# EAGLE design poe-neopixel-controller-v2 (EAGLE 7.7.0)

## Sheet 1 of 2
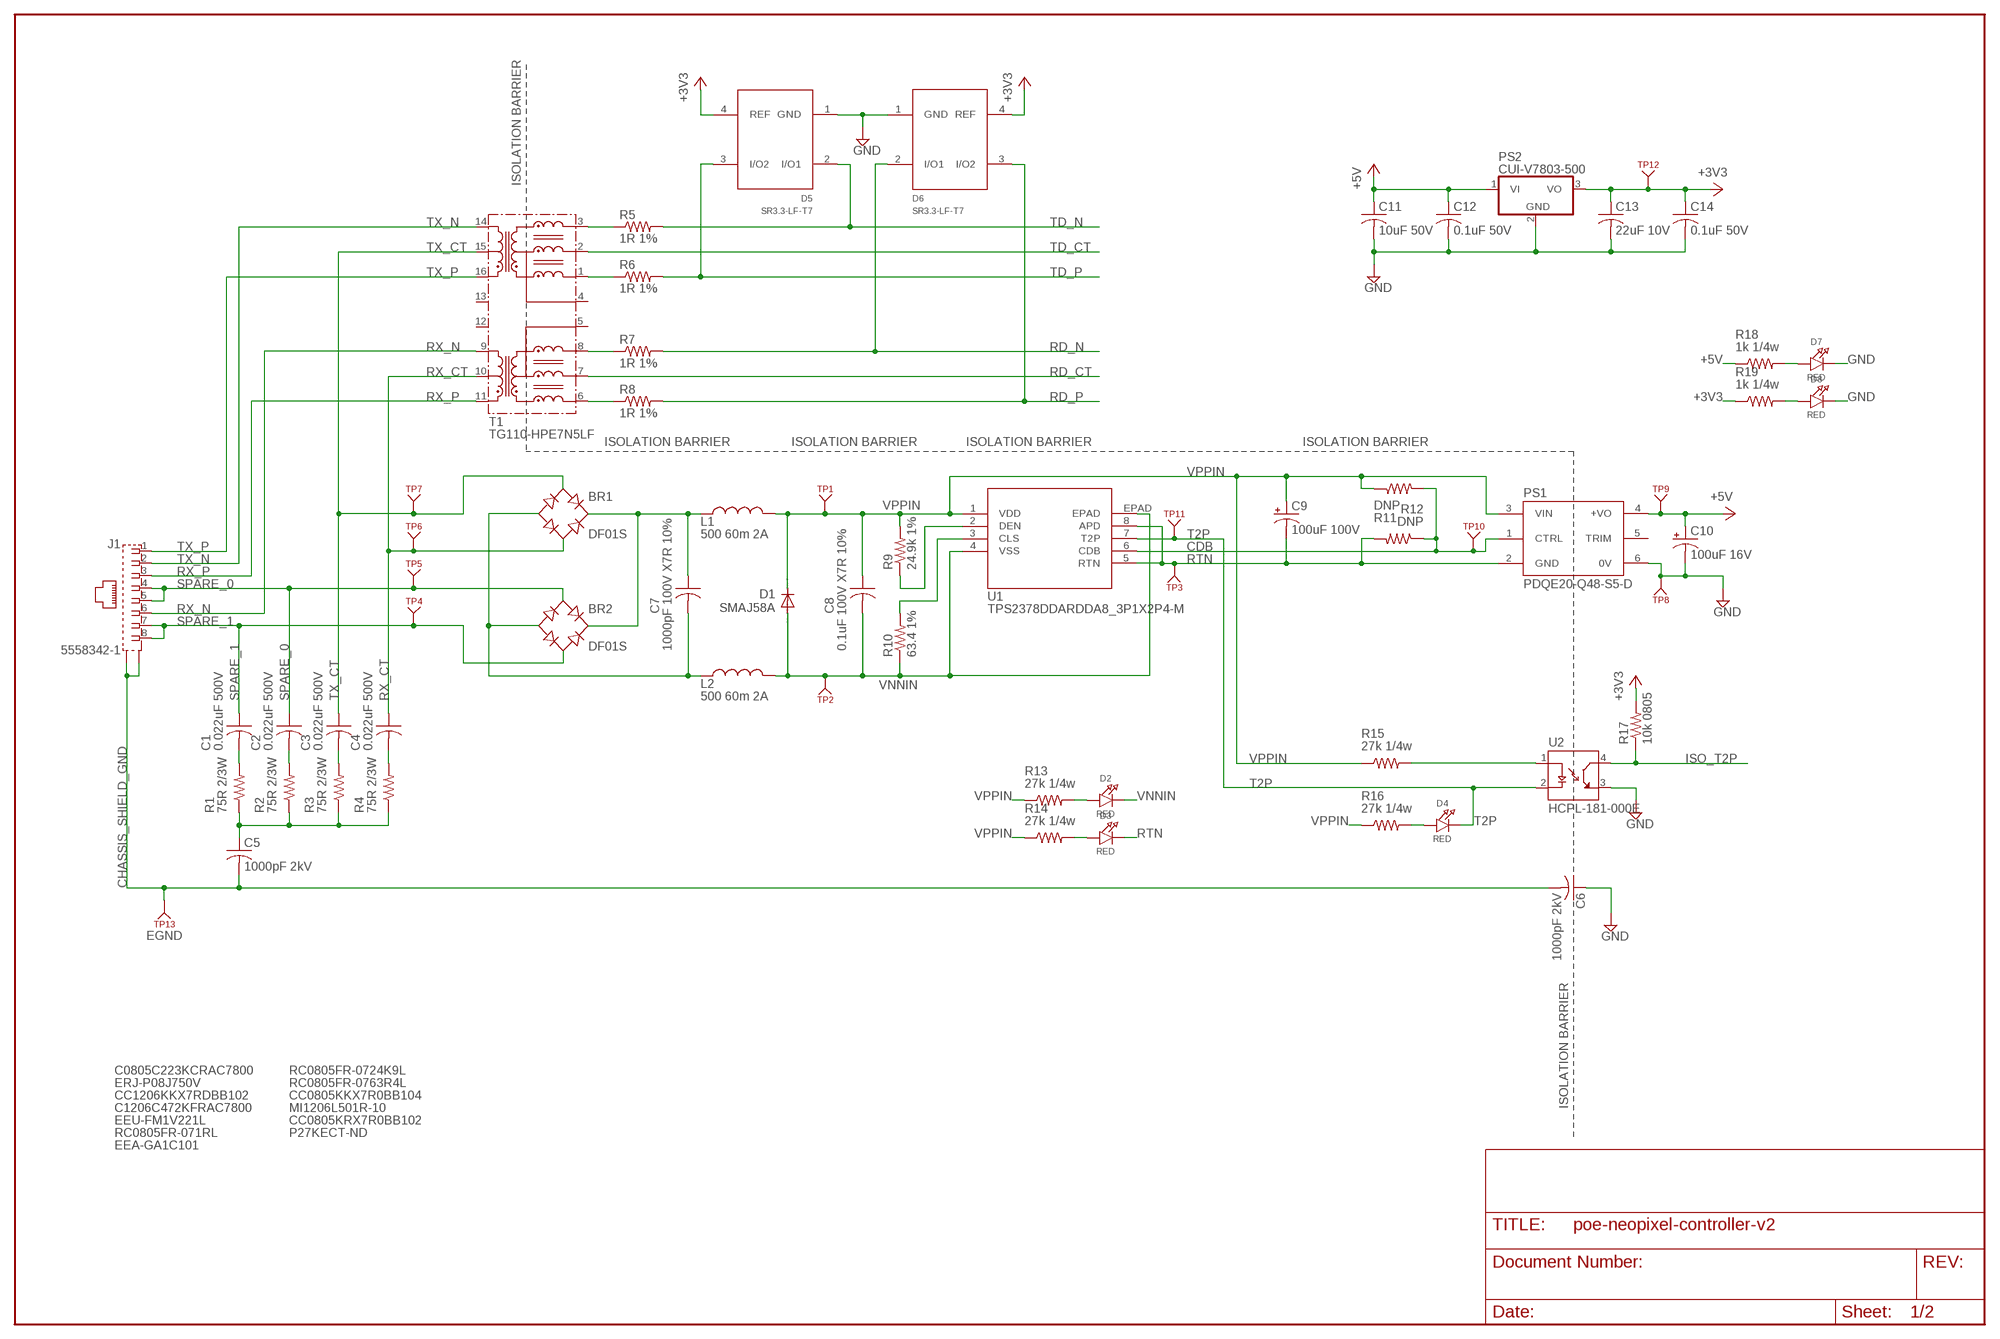
[diagram p0: schematic, sheet 1]

### Parts
BR1  DF01S  [DFS]
BR2  DF01S  [DFS]
C1  0.022uF 500V  C-USC1206  [C1206]
C2  0.022uF 500V  C-USC1206  [C1206]
C3  0.022uF 500V  C-USC1206  [C1206]
C4  0.022uF 500V  C-USC1206  [C1206]
C5  1000pF 2kV  C-USC1206K  [C1206K]
C6  1000pF 2kV  C-USC1206K  [C1206K]
C7  1000pF 100V X7R 10%  C-USC0805  [C0805]
C8  0.1uF 100V X7R 10%  C-USC0805  [C0805]
C9  100uF 100V  CPOL-USE5-10.5  [E5-10,5]
C10  100uF 16V  CPOL-USE2.5-7  [E2,5-7]
C11  10uF 50V  C-USC1210K  [C1210K]
C12  0.1uF 50V  C-USC0805  [C0805]
C13  22uF 10V  C-USC1206K  [C1206K]
C14  0.1uF 50V  C-USC0805  [C0805]
D1  SMAJ58A  DIODE-DO214AC  [DO214AC]
D2  RED  LED0805_NOOUTLINE  [CHIPLED_0805_NOOUTLINE]
D3  RED  LED0805_NOOUTLINE  [CHIPLED_0805_NOOUTLINE]
D4  RED  LED0805_NOOUTLINE  [CHIPLED_0805_NOOUTLINE]
D5  SR3.3-LF-T7  [SOT143B]
D6  SR3.3-LF-T7  [SOT143B]
D7  RED  LED0805_NOOUTLINE  [CHIPLED_0805_NOOUTLINE]
D8  RED  LED0805_NOOUTLINE  [CHIPLED_0805_NOOUTLINE]
J1  5558342-1  [TE_5558342-1]
L1  500 60m 2A  L-USL3216C  [L3216C]
L2  500 60m 2A  L-USL3216C  [L3216C]
PS1  PDQE20-Q48-S5-D  [CONV_PDQE20-Q48-S5-D]
PS2  CUI-V7803-500  [CUI-78XX-500]
R1  75R 2/3W  R-US_R1206  [R1206]
R2  75R 2/3W  R-US_R1206  [R1206]
R3  75R 2/3W  R-US_R1206  [R1206]
R4  75R 2/3W  R-US_R1206  [R1206]
R5  1R 1%  R-US_R0805  [R0805]
R6  1R 1%  R-US_R0805  [R0805]
R7  1R 1%  R-US_R0805  [R0805]
R8  1R 1%  R-US_R0805  [R0805]
R9  24.9k 1%  R-US_R0805  [R0805]
R10  63.4 1%  R-US_R0805  [R0805]
R11  DNP  R-US_R1206  [R1206]
R12  DNP  R-US_R1206  [R1206]
R13  27k 1/4w  R-US_R1206  [R1206]
R14  27k 1/4w  R-US_R1206  [R1206]
R15  27k 1/4w  R-US_R1206  [R1206]
R16  27k 1/4w  R-US_R1206  [R1206]
R17  10k 0805  R-US_R0805  [R0805]
R18  1k 1/4w  R-US_R0805  [R0805]
R19  1k 1/4w  R-US_R0805  [R0805]
T1  TG110-HPE7N5LF  [RP-ULTRA]
TP1  KEYSTONE_500X  [KEYSTONE_TP500X]
TP2  KEYSTONE_500X  [KEYSTONE_TP500X]
TP3  KEYSTONE_500X  [KEYSTONE_TP500X]
TP4  KEYSTONE_500X  [KEYSTONE_TP500X]
TP5  KEYSTONE_500X  [KEYSTONE_TP500X]
TP6  KEYSTONE_500X  [KEYSTONE_TP500X]
TP7  KEYSTONE_500X  [KEYSTONE_TP500X]
TP8  KEYSTONE_500X  [KEYSTONE_TP500X]
TP9  KEYSTONE_500X  [KEYSTONE_TP500X]
TP10  KEYSTONE_500X  [KEYSTONE_TP500X]
TP11  KEYSTONE_500X  [KEYSTONE_TP500X]
TP12  KEYSTONE_500X  [KEYSTONE_TP500X]
TP13  KEYSTONE_500X  [KEYSTONE_TP500X]
U1  TPS2378DDARDDA8_3P1X2P4-M  [DDA8_3P1X2P4-M]
U2  HCPL-181-000E  [SOIC254P675X240-4N]

### Nets
+3V3: C13.1 C14.1 D5.4(REF) D6.4(REF) PS2.3(VO) R17.2 R19.1 TP12.1 ; also sheet 2
+5V: C10.+ C11.1 C12.1 PS1.4(+VO) PS2.1(VI) R18.1 TP9.1 ; also sheet 2
CDB: PS1.1(CTRL) R11.2 R12.1 TP10.1 U1.6(CDB)
CHASSIS_SHIELD_GND: C5.2 C6.2 J1.SH1(S1) J1.SH2(S2) TP13.1
GND: C6.1 C10.- C11.2 C12.2 C13.2 C14.2 D5.1(GND) D6.1(GND) D7.C D8.C PS1.6(0V) PS2.2(GND) TP8.1 U2.3(EMITTER) ; also sheet 2
ISO_T2P: R17.1 U2.4(COLLECTOR) ; also sheet 2
N$1: BR1.+ BR2.+ C7.1 L1.1
N$2: R5.1 T1.3
N$3: BR1.- BR2.- C7.2 L2.1
N$4: R6.1 T1.1
N$5: C4.2 R4.2
N$6: R7.1 T1.8
N$7: D2.A R13.2
N$12: R15.2 U2.1(ANODE)
N$13: R8.1 T1.6
N$14: C1.2 R1.2
N$15: C2.2 R2.2
N$16: C3.2 R3.2
N$17: C5.1 R1.1 R2.1 R3.1 R4.1
N$19: R9.1 U1.2(DEN)
N$20: R10.2 U1.3(CLS)
N$22: D3.A R14.2
N$23: D4.A R16.2
N$24: D7.A R18.2
N$25: D8.A R19.2
RD_CT: T1.7 ; also sheet 2
RD_N: D6.2(I/O1) R7.2 ; also sheet 2
RD_P: D6.3(I/O2) R8.2 ; also sheet 2
RTN: C9.- D3.C PS1.2(GND) R12.2 TP3.1 U1.5(RTN) U1.8(APD)
RX_CT: BR1.AC2 C4.1 T1.10 TP6.1
RX_N: J1.6 T1.9
RX_P: J1.3 T1.11
SPARE_0: BR2.AC1 C2.1 J1.4 J1.5 TP5.1
SPARE_1: BR2.AC2 C1.1 J1.7 J1.8 TP4.1
T2P: D4.C TP11.1 U1.7(T2P) U2.2(CATHODE)
TD_CT: T1.2 ; also sheet 2
TD_N: D5.2(I/O1) R5.2 ; also sheet 2
TD_P: D5.3(I/O2) R6.2 ; also sheet 2
TX_CT: BR1.AC1 C3.1 T1.15 TP7.1
TX_N: J1.2 T1.14
TX_P: J1.1 T1.16
VNNIN: C8.2 D1.A D2.C L2.2 R10.1 TP2.1 U1.4(VSS) U1.EPAD
VPPIN: C8.1 C9.+ D1.C L1.2 PS1.3(VIN) R9.2 R11.1 R13.1 R14.1 R15.1 R16.1 TP1.1 U1.1(VDD)
Unconnected: PS1.5(TRIM) T1.4 T1.5 T1.12 T1.13

### Notes on the sheet
- ISOLATION BARRIER
- ISOLATION BARRIER | ISOLATION BARRIER | ISOLATION BARRIER | ISOLATION BARRIER
- EGND
- C0805C223KCRAC7800 | RC0805FR-0724K9L
- ERJ-P08J750V | RC0805FR-0763R4L
- CC1206KKX7RDBB102 | CC0805KKX7R0BB104
- ISOLATION BARRIER
- C1206C472KFRAC7800 | MI1206L501R-10
- EEU-FM1V221L | CC0805KRX7R0BB102
- RC0805FR-071RL | P27KECT-ND
- EEA-GA1C101

## Sheet 2 of 2
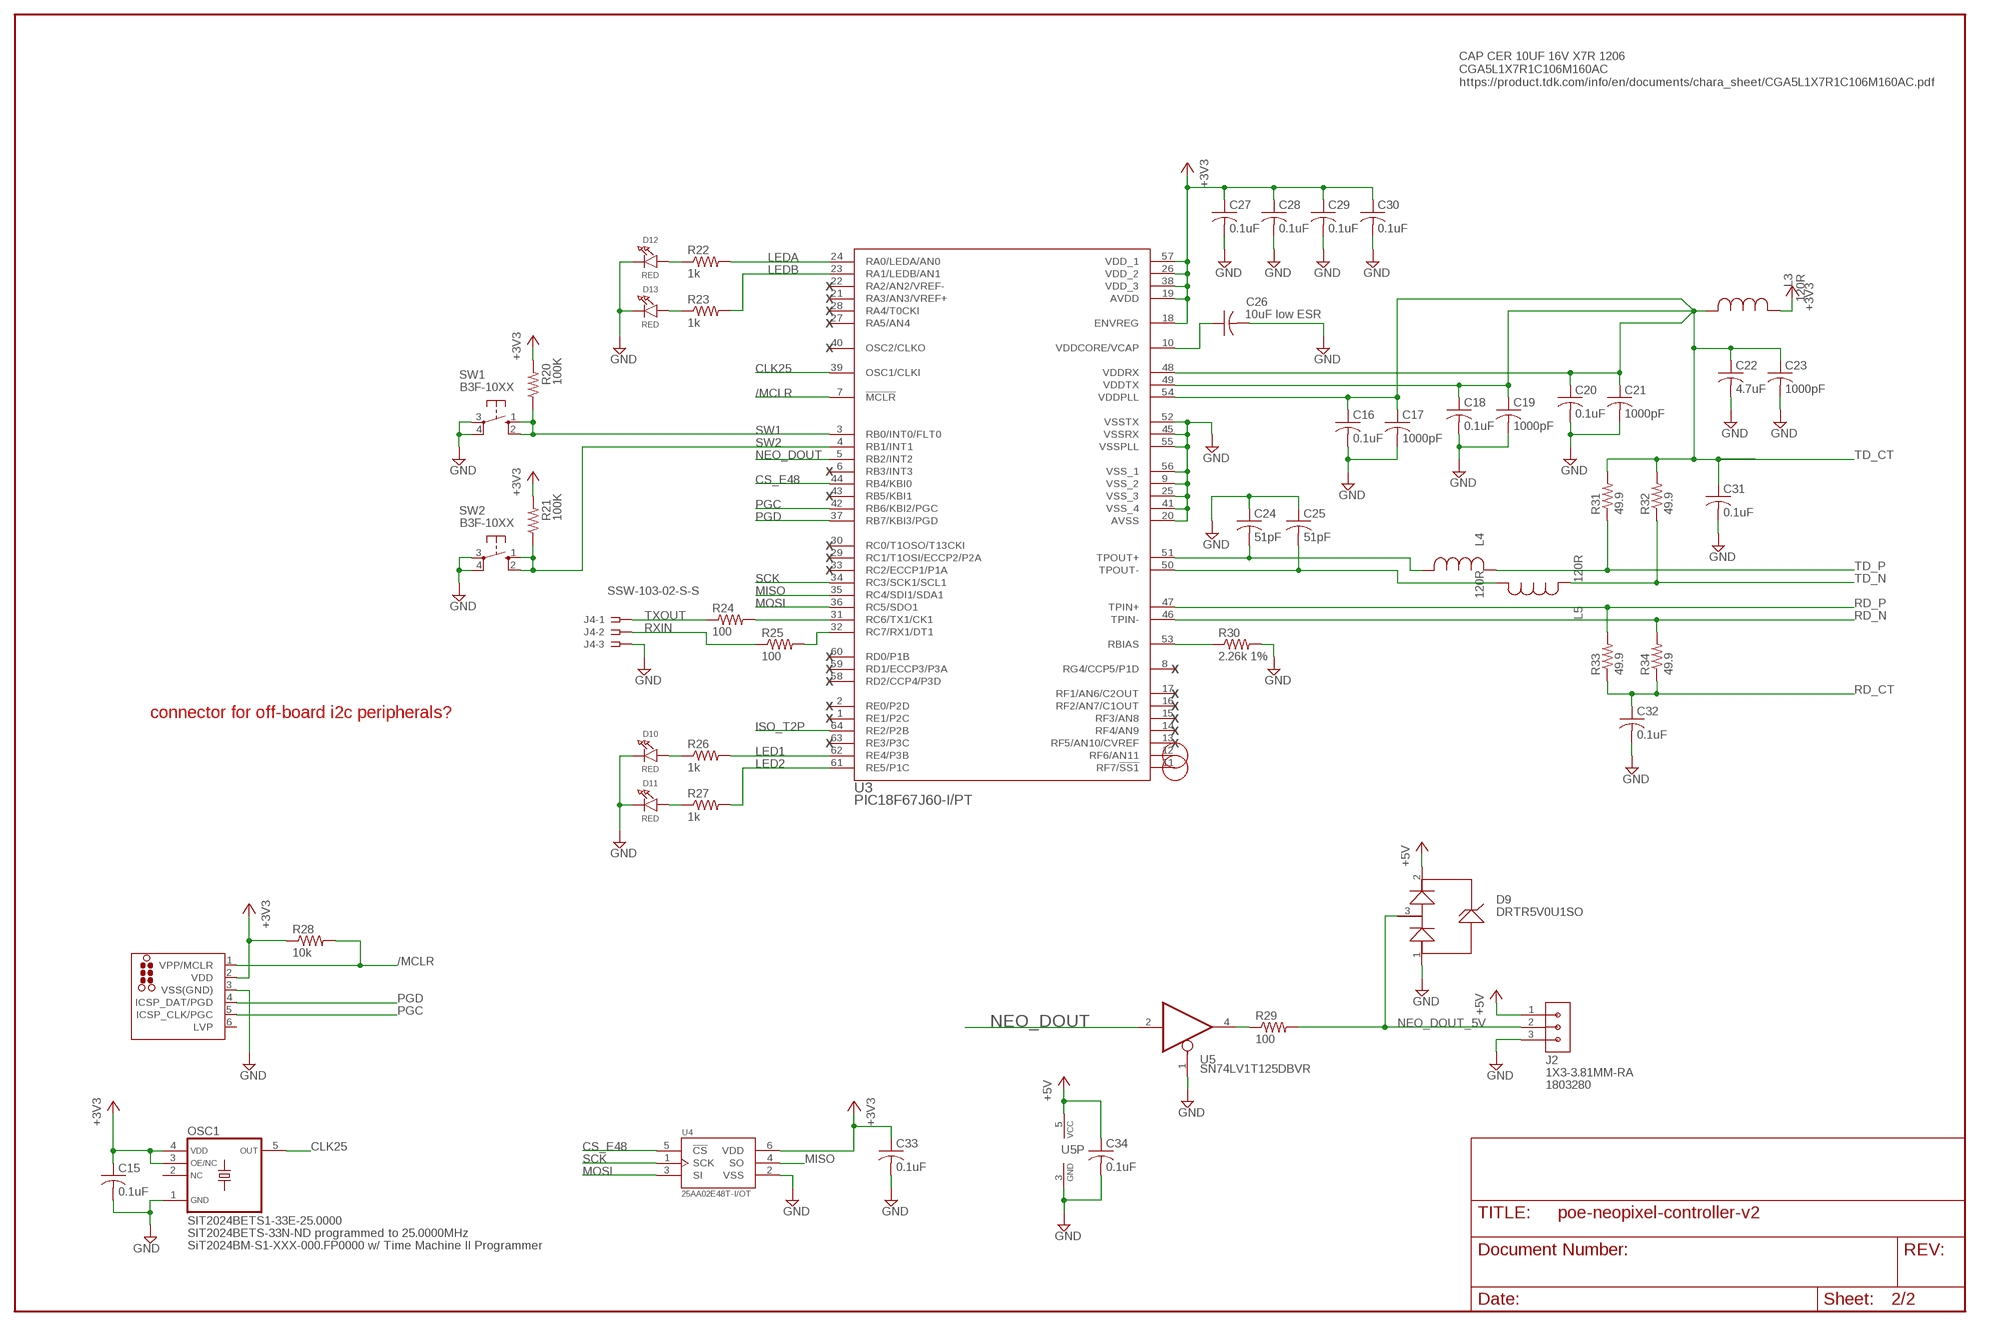
[diagram p1: schematic, sheet 2]

### Parts
C15  0.1uF  C-USC0603  [C0603]
C16  0.1uF  C-USC0805  [C0805]
C17  1000pF  C-USC0805  [C0805]
C18  0.1uF  C-USC0805  [C0805]
C19  1000pF  C-USC0805  [C0805]
C20  0.1uF  C-USC0805  [C0805]
C21  1000pF  C-USC0805  [C0805]
C22  4.7uF  C-USC0805  [C0805]
C23  1000pF  C-USC0805  [C0805]
C24  51pF  C-USC0805  [C0805]
C25  51pF  C-USC0805  [C0805]
C26  10uF low ESR  C-USC1206  [C1206]
C27  0.1uF  C-USC0603  [C0603]
C28  0.1uF  C-USC0603  [C0603]
C29  0.1uF  C-USC0603  [C0603]
C30  0.1uF  C-USC0603  [C0603]
C31  0.1uF  C-USC0805  [C0805]
C32  0.1uF  C-USC0805  [C0805]
C33  0.1uF  C-USC0603  [C0603]
C34  0.1uF  C-USC0603  [C0603]
D9  DRTR5V0U1SO  [SOT23-3]
D10  RED  LED0805_NOOUTLINE  [CHIPLED_0805_NOOUTLINE]
D11  RED  LED0805_NOOUTLINE  [CHIPLED_0805_NOOUTLINE]
D12  RED  LED0805_NOOUTLINE  [CHIPLED_0805_NOOUTLINE]
D13  RED  LED0805_NOOUTLINE  [CHIPLED_0805_NOOUTLINE]
J2  1X3-3.81MM-RA  CON-3.81MM-1X3-PHOENIX-RA  [CON-PHOENIX-3.81-1X3-RA]
J3  TC2030-MCP-NL  [TC2030-MCP-NL]
J4  SSW-103-02-S-S  [SSW-103-02-S-S]
L3  120R  MMZ1608B121CTAH0IND_1608-M  [IND_1608-M]
L4  120R  MMZ1608B121CTAH0IND_1608-M  [IND_1608-M]
L5  120R  MMZ1608B121CTAH0IND_1608-M  [IND_1608-M]
OSC1  SIT2024BETS1-33E-25.0000  SIT2024BETS1-33E-10.0000  [SOT23-5]
R20  100K  R-US_R0805  [R0805]
R21  100K  R-US_R0805  [R0805]
R22  1k  R-US_R0805  [R0805]
R23  1k  R-US_R0805  [R0805]
R24  100  R-US_R0805  [R0805]
R25  100  R-US_R0805  [R0805]
R26  1k  R-US_R0805  [R0805]
R27  1k  R-US_R0805  [R0805]
R28  10k  R-US_R0805  [R0805]
R29  100  R-US_R0805  [R0805]
R30  2.26k 1%  R-US_R0805  [R0805]
R31  49.9  R-US_R0805  [R0805]
R32  49.9  R-US_R0805  [R0805]
R33  49.9  R-US_R0805  [R0805]
R34  49.9  R-US_R0805  [R0805]
SW1  B3F-10XX  10-XX  [B3F-10XX]
SW2  B3F-10XX  10-XX  [B3F-10XX]
U3  PIC18F67J60-I/PT  [TQFP64_10X10MC]
U4  25AA02E48T-I/OT  [SOT95P270X145-6N]
U5  SN74LV1T125DBVR  74AHC1G125DBV  [SOT23-5]

### Nets
+3V3: C15.1 C27.1 C28.1 C29.1 C30.1 C33.1 J3.2(VDD) L3.2 OSC1.3(OE/NC) OSC1.4(VDD) R20.2 R21.2 R28.1 U3.18(ENVREG) U3.19(AVDD) U3.26(VDD_2) U3.38(VDD_3) U3.57(VDD_1) U4.6(VDD) ; also sheet 1
+5V: C34.1 D9.2 J2.1 U5.5(VCC) ; also sheet 1
/MCLR: J3.1(VPP/MCLR) R28.2 U3.7(!MCLR)
CLK25: OSC1.5(OUT) U3.39(OSC1/CLKI)
CS_E48: U3.44(RB4/KBI0) U4.5(!CS)
DATA_5V: R29.1 U5.4(O)
GND: C15.2 C16.2 C17.2 C18.2 C19.2 C20.2 C21.2 C22.2 C23.2 C24.1 C25.1 C26.2 C27.2 C28.2 C29.2 C30.2 C31.2 C32.2 C33.2 C34.2 D9.1 D10.C D11.C D12.C D13.C J2.3 J3.3(VSS(GND)) J4.3 OSC1.1(GND) R30.2 SW1.3(P) SW1.4(P1) SW2.3(P) SW2.4(P1) U3.9(VSS_2) U3.20(AVSS) U3.25(VSS_3) U3.41(VSS_4) U3.45(VSSRX) U3.52(VSSTX) U3.55(VSSPLL) U3.56(VSS_1) U4.2(VSS) U5.1(OE) U5.3(GND) ; also sheet 1
ISO_T2P: U3.64(RE2/P2B) ; also sheet 1
LED1: R26.2 U3.62(RE4/P3B)
LED2: R27.2 U3.61(RE5/P1C)
LEDA: R22.2 U3.24(RA0/LEDA/AN0)
LEDB: R23.2 U3.23(RA1/LEDB/AN1)
MISO: U3.35(RC4/SDI1/SDA1) U4.4(SO)
MOSI: U3.36(RC5/SDO1) U4.3(SI)
N$8: C26.1 U3.10(VDDCORE/VCAP)
N$9: R30.1 U3.53(RBIAS)
N$10: D13.A R23.1
N$11: D10.A R26.1
N$18: D11.A R27.1
N$21: D12.A R22.1
NEO_DOUT: U3.5(RB2/INT2) U5.2(I)
NEO_DOUT_5V: D9.3 J2.2 R29.2
PGC: J3.5(ICSP_CLK/PGC) U3.42(RB6/KBI2/PGC)
PGD: J3.4(ICSP_DAT/PGD) U3.37(RB7/KBI3/PGD)
RD_CT: C32.1 R33.1 R34.1 ; also sheet 1
RD_N: R34.2 U3.46(TPIN-) ; also sheet 1
RD_P: R33.2 U3.47(TPIN+) ; also sheet 1
RXD: R25.2 U3.32(RC7/RX1/DT1)
RXIN: J4.2 R25.1
SCK: U3.34(RC3/SCK1/SCL1) U4.1(SCK)
SW1: R20.1 SW1.1(S) SW1.2(S1) U3.3(RB0/INT0/FLT0)
SW2: R21.1 SW2.1(S) SW2.2(S1) U3.4(RB1/INT1)
TD_CT: C16.1 C17.1 C18.1 C19.1 C20.1 C21.1 C22.1 C23.1 C31.1 L3.1 R31.2 R32.2 U3.48(VDDRX) U3.49(VDDTX) U3.54(VDDPLL) ; also sheet 1
TD_N: L5.2 R32.1 ; also sheet 1
TD_P: L4.2 R31.1 ; also sheet 1
TDF_N: C25.2 L5.1 U3.50(TPOUT-)
TDF_P: C24.2 L4.1 U3.51(TPOUT+)
TXD: R24.2 U3.31(RC6/TX1/CK1)
TXOUT: J4.1 R24.1
Unconnected: J3.6(LVP) OSC1.2(NC) U3.1(RE1/P2C) U3.2(RE0/P2D) U3.6(RB3/INT3) U3.8(RG4/CCP5/P1D) U3.11(RF7/!SS1) U3.12(RF6/AN11) U3.13(RF5/AN10/CVREF) U3.14(RF4/AN9) U3.15(RF3/AN8) U3.16(RF2/AN7/C1OUT) U3.17(RF1/AN6/C2OUT) U3.21(RA3/AN3/VREF+) U3.22(RA2/AN2/VREF-) U3.27(RA5/AN4) U3.28(RA4/T0CKI) U3.29(RC1/T1OSI/ECCP2/P2A) U3.30(RC0/T1OSO/T13CKI) U3.33(RC2/ECCP1/P1A) U3.40(OSC2/CLKO) U3.43(RB5/KBI1) U3.58(RD2/CCP4/P3D) U3.59(RD1/ECCP3/P3A) U3.60(RD0/P1B) U3.63(RE3/P3C)

### Notes on the sheet
- CAP CER 10UF 16V X7R 1206
  CGA5L1X7R1C106M160AC 
  https://product.tdk.com/info/en/documents/chara_sheet/CGA5L1X7R1C106M160AC.pdf
- X
- X
- X
- X
- X
- X
- X
- X
- X
- X
- X
- X | X
- X
- X
- X | X
- connector for off-board i2c peripherals? | X | X
- X
- X | X
- SIT2024BETS-33N-ND programmed to 25.0000MHz
- SiT2024BM-S1-XXX-000.FP0000 w/ Time Machine II Programmer

## Library data of the parts
BR1 BR2 = rectifier:DF*S: Surface Mount Glass Passivated Bridge Rectifiers Source: Source: Comchip Bridge Rectifiers DF005S-G thru DF10S-G.pdf
C1-C8 C15-C25 C27-C34 = rcl:C-US: CAPACITOR, American symbol
C9 C10 = rcl:CPOL-US: POLARIZED CAPACITOR, American symbol
C11 = rcl:C-US: CAPACITOR, American symbol; MFR: KEMET; MFR_PART_NO: C1210C106K5RACTU
C12 C14 = rcl:C-US: CAPACITOR, American symbol; MFR: KEMET; MFR_PART_NO: C1206S104M5RACTU
C13 = rcl:C-US: CAPACITOR, American symbol; MFR: KEMET; MFR_PART_NO: C1206C226K8RAC7800
C26 = resistor:C-US: CAPACITOR, American symbol
D1 = diode:DIODE-: DIODE
D2-D4 D7 D8 D10-D13 = microbuilder:LED: LED 0603 - 0603 Surface Mount Package 2mA: Green LED - Low Power (3.9mcd, 2ma, 1.7Vf) - Digikey: 475-2709-2-ND Orange LED - Low Power (9.8mcd, 2ma, 1.8Vf) - Digikey: 475-1194-2-ND Red LED - Low Power (5mcd, 2ma, 1.8Vf) - Digikey: 475-1195-2-ND Yellow LED - Low Power (7mcd, 2ma, 1.8Vf) - Digikey: 475-1196-2-ND 5mA: Blue LED - Low Power (17mcd, 5ma, 2.9Vf) - Digikey: LNJ937W8CRACT-ND 0805 - 0805 Surface Mount Package 2mA: Red LED (8.8mcd, 2mA, 1.8Vf, Clear) - Low Power [Digikey: 475-2510-1-ND] Green LED (5mcd, 2mA, 1.8Vf, Clear) - Low Power [Digikey: 475-2730-1-ND] Yellow LED (11.3mcd, 2mA, 1.8Vf, Clear) - Low Power [Digikey: 475-2555-1-ND] 20mA: Red LED (104mcd, 20mA, Diffused) - LS R976 [Digikey: 475-1278-6-ND] Red LED (12mcd, 20mA, 2.0Vf, Clear) - APT2012EC [Digikey: 754-1128-1-ND] Green LED (15mcd, 20mA, 2.2Vf, Clear) - APT2012GC [Digikey: 754-1131-1-ND] Orange LED (160mcd, 20mA, 2.1Vf, Clear) - APT2012SECK [Digikey: 754-1130-1-ND] 1206 - 1206 Surface Mount Package Green LED (26mcd, 20mA, Diffused) - LG N971 [Digikey: 475-1407-6-ND] Red LED (15mcd, 20mA, Diffused) - LH N974 [Digikey: 475-1416-6-ND] Cree - Cree High-Power Surface Mount LEDs XPEBWT-L1-0000-00D50 - White 111lm 350mA 2.9Vf 6200K 110° XTEAWT-00-0000-00000LEE3 - White 114lm 350mA 2.85Vf 5000K 115° Everlight - Everlight 45-21 Series Surface Mount LEDs 45-21/QK2C-B2832AC2CB2/2T - Warm White 2000mcd 20mA 3.25Vf 3050K 120° 45-21/LK2C-B38452C4CB2/2T - Nuetral White 2000mcd 20mA 3.25Vf 4150K 120° 45-21/LK2C-B50634C6CB2/2T - Cold White 2200mcd 20mA 3.25Vf 5650K 120° PLCC2 Reverse Mount LS T77K-J1L2-1-0-2-R18-Z - Red 11.25mcd 2mA 1.8Vf 630nm 120° LO T77K-L1M2-24-Z - Orange 19.6mcd 2mA 1.8Vf 606nm 120° LY T77K-K2M1-26-Z - Yellow 15.7mcd 2mA 1.8Vf 587nm 120°
D5 D6 = protek-devices:SR3.3-LF-T7
D9 = GlenPartsLibrary:DRTR5V0U1SO; MFR: DIODES INC; MFR_PART_NO: DRTR5V0U1SO
J1 = 5558342-1:5558342-1: CONN MOD JACK 8P8C R/A SHIELDED; COMMENT: 5558342-1; DESCRIPTION: Conn RJ-45 F 8 POS 2.54mm Solder RA Thru-Hole 8 Terminal 1 Port Cat 5 Box/Tray; DIGI-KEY_PART_NUMBER: A31466-ND; DIGI-KEY_PURCHASE_URL: https://www.digikey.com/product-detail/en/te-connectivity-amp-connectors/5558342-1/A31466-ND/769610?utm_source=snapeda&utm_medium=aggregator&utm_campaign=symbol; EU_ROHS_COMPLIANCE: Compliant; MF: TE Connectivity; MP: 5558342-1; PACKAGE: None; TE_PURCHASE_URL: https://www.te.com/usa-en/product-5558342-1.html?te_bu=Cor&te_type=disp&te_campaign=seda_glo_cor-seda-global-disp-prtnr-fy19-seda-model-bom-cta_sma-317_1&elqCampaignId=32493
J2 = 0GlenConnectors:CON-3.81MM-1X3-PHOENIX-RA; MATES_WITH: 1803581; MFR: PHOENIX; MFR_PART_NO: 1803280
J3 = tag-connect:TC2030: TAG-CONNECT ICSP Connector Manufacturer: Tag-Connect <http://www.tag-connect.com> Cable for easy In-Circuit Serial Programming. Designed for Microchip ICD2, suitable for many others. Two variants - one "with legs" (for hands-free fit on PCB) and another "without legs" for quick programming. PAD Description 1 MCLR/Vpp 2 Vdd 3 GND 4 PGD (ISPDAT) 5 PGC (ISPCLK) 6 nc (used for LVP) ©2009 ROFA.cz - modified and updated by Robert Darlington ‹rdarlington@gmail.com›
J4 = con-samtec:SSW-103-02-S-S: THROUGH-HOLE .025" SQ POST SOCKET Source: Samtec SSW.pdf; MPN: SSW-103-02-S-S; OC_FARNELL: unknown; OC_NEWARK: 11P9367
L1 L2 = rcl:L-US: INDUCTOR, American symbol
L3-L5 = MMZ1608B121CTAH0:MMZ1608B121CTAH0; BUILT_BY: EMA_UL_Team; MANUFACTURER_PART_NUMBER: MMZ1608B121CTAH0; VENDOR: TDK
OSC1 = Glen-SiTime:SIT2024BETS1-33E-10.0000
PS1 = PDQE20-Q48-S5-D:PDQE20-Q48-S5-D: 20 W, 4:1 Input Range, Single/Dual Regulated Output, DIP, 1500 Vdc Isolation, DC-Dc Converter; CUI_PURCHASE_URL: https://www.cui.com/product/dc-dc-converters/isolated/pdqe20-d-series?utm_source=snapeda.com&utm_medium=referral&utm_campaign=snapedaBOM; DESCRIPTION: 20 W, 4:1 Input Range, Single/Dual Regulated Output, DIP, 1500 Vdc Isolation, Dc-Dc Converter; DIGI-KEY_PART_NUMBER: 102-6272-ND; DIGI-KEY_PURCHASE_URL: https://www.digikey.com/product-detail/en/cui-inc/PDQE20-Q48-S5-D/102-6272-ND/10230161?utm_source=snapeda&utm_medium=aggregator&utm_campaign=symbol; MF: CUI Inc.; MP: PDQE20-Q48-S5-D; PACKAGE: DIP-6 CUI Inc.
PS2 = GlenPartsLibrary:CUI-V7803-500
R1-R16 R18-R34 = rcl:R-US_: RESISTOR, American symbol
R17 = resistor:R-US_: RESISTOR, American symbol
SW1 SW2 = switch-omron:10-XX: OMRON SWITCH
T1 = halo-rp-ultra-magnetics:TG110-HPE7N5LF
TP1-TP13 = 0GlenConnectors:KEYSTONE_500X
U1 = TPS2378DDAR:TPS2378DDAR; MANUFACTURER_PART_NUMBER: TPS2378DDAR; VENDOR: Texas Instruments
U2 = HCPL-181-000E:HCPL-181-000E: Optocoupler; SMD; Channels: 1; Out: transistor; Uinsul: 3.75kV; SO4; DESCRIPTION: Optocoupler; SMD; Channels: 1; Out: transistor; Uinsul: 3.75kV; SO4; DIGI-KEY_PART_NUMBER: 516-1646-1-ND; DIGI-KEY_PURCHASE_URL: https://www.digikey.com/product-detail/en/broadcom-limited/HCPL-181-000E/516-1646-1-ND/825340?utm_source=snapeda&utm_medium=aggregator&utm_campaign=symbol; MF: Broadcom Limited; MP: HCPL-181-000E; PACKAGE: SO-4 Broadcom
U3 = pic18f67j60:PIC18F67J60-I/PT; MANUFACTURER_PART_NUMBER: PIC18F67J60IPT; VENDOR: Microchip
U4 = 25AA02E48T-I_OT:25AA02E48T-I/OT: 25AA02E48 Series 2 Kbit (256 x 8) 5.5 V SMT SPI Bus Serial EEPROM - SOT-23-6; DESCRIPTION: 25AA02E48 Series 2 Kbit _256 x 8_ 5.5 V SMT SPI Bus Serial EEPROM - SOT-23-6; DIGI-KEY_PART_NUMBER: 25AA02E48T-I/OTCT-ND; DIGI-KEY_PURCHASE_URL: https://www.digikey.com/product-detail/en/microchip-technology/25AA02E48T-I-OT/25AA02E48T-I-OTCT-ND/2060055?utm_source=snapeda&utm_medium=aggregator&utm_campaign=symbol; MF: Microchip; MP: 25AA02E48T-I/OT; PACKAGE: SOT-23-6 Microchip
U5 = 74xx-little-us:74*1G125: Single Bus Buffer Gate with 3-State Output; MFR: TI; MFR_PART_NO: SN74LV1T125DBVR

## Board
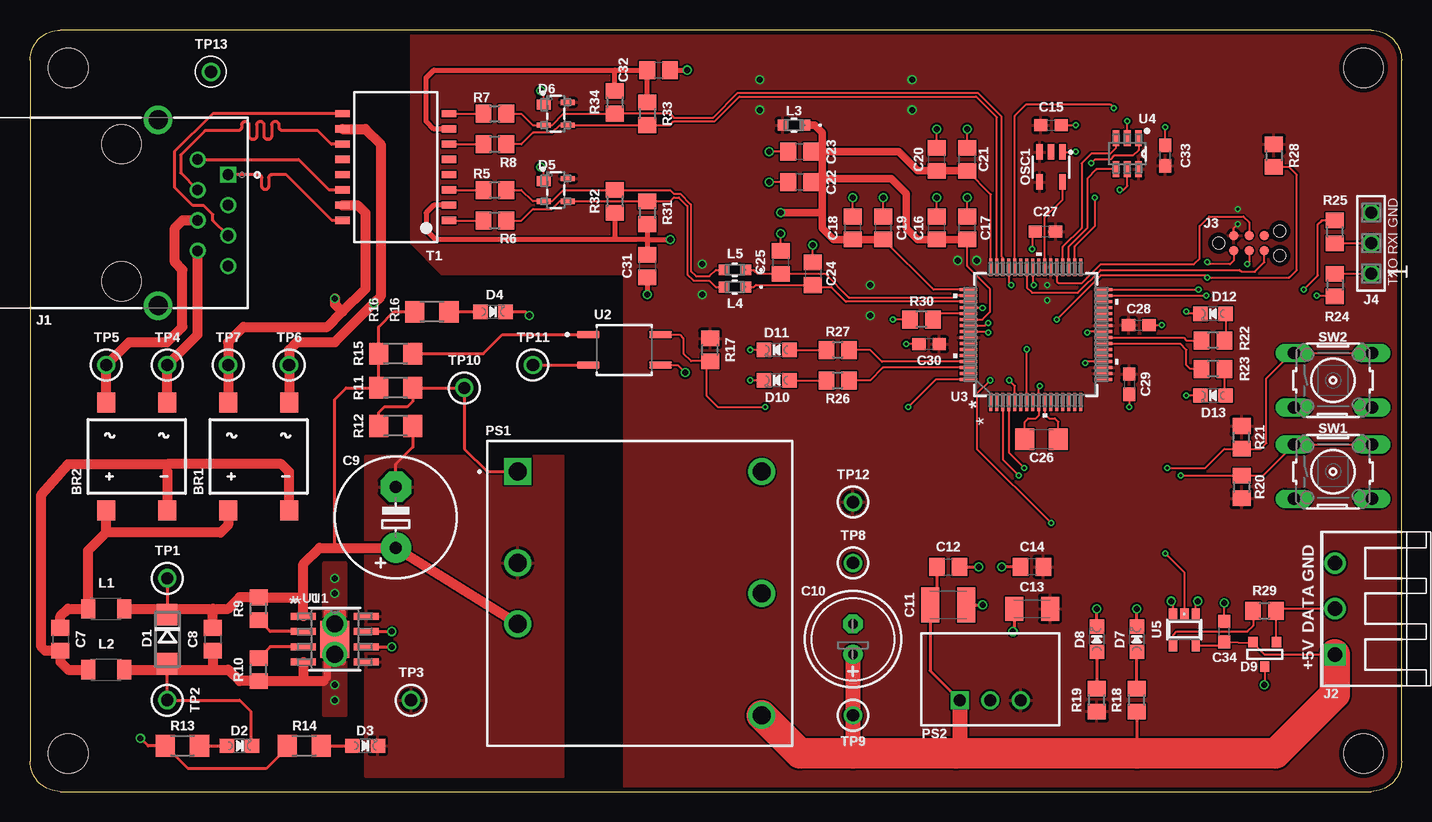
[diagram p2: board, top side]
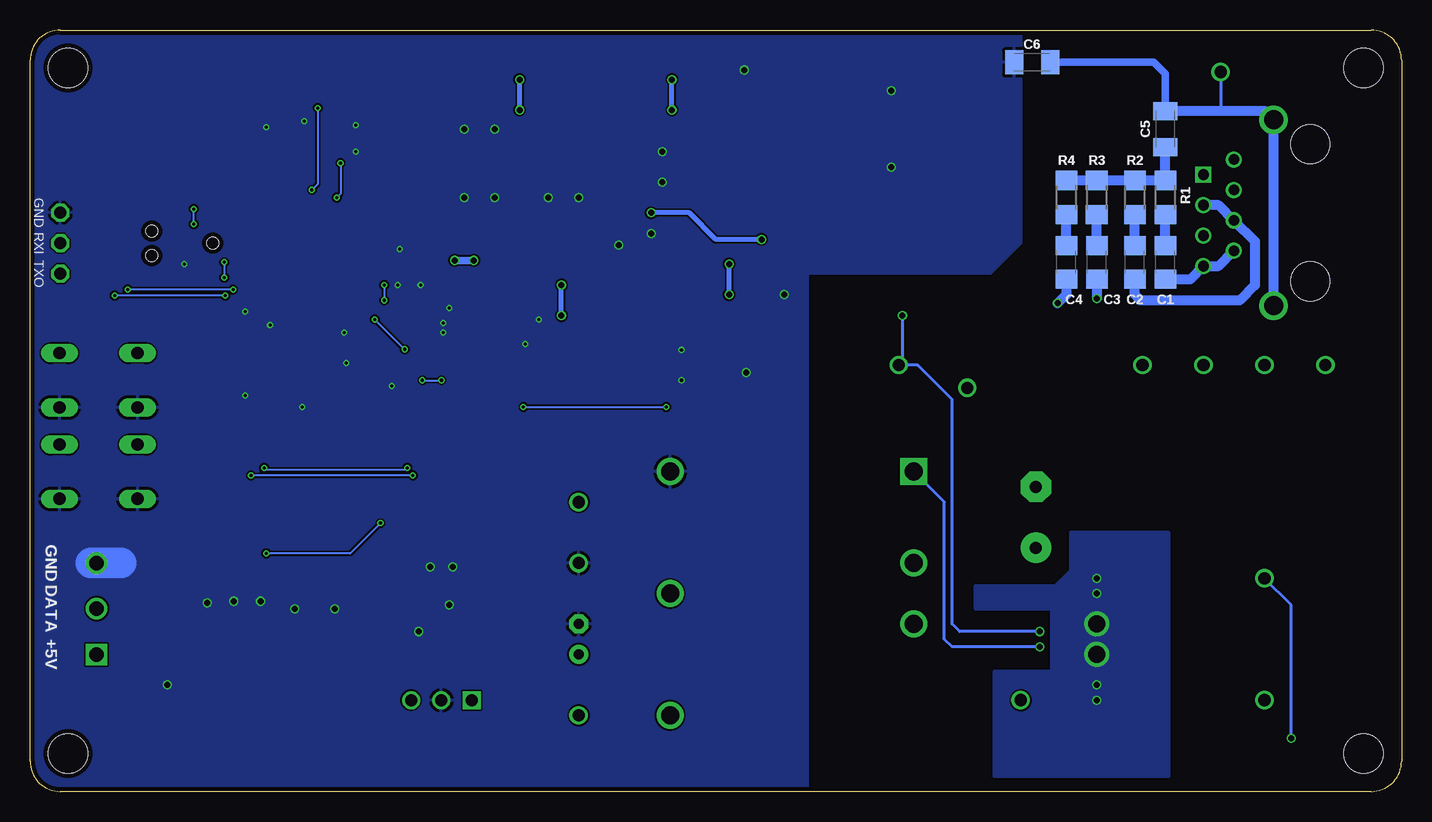
[diagram p3: board, bottom side, seen from below]

Size 114.3 x 63.5 mm. Coordinates in mm from the lower left corner, seen from the top.
Outline: 2.54,0 111.76,0 arc90 114.3,2.54 114.3,60.96 arc90 111.76,63.5 2.54,63.5 arc90 0,60.96 0,2.54 arc90 2.54,0
Copper layers (1*16): Top 0.035559375mm / dielectric 1.6mm / Bottom 0.035559375mm
Design rules "oshpark-2layer-2018": minimum track width 6mil, minimum drill 10mil, track to track 6mil, track to pad 6mil, pad to pad 6mil, via to via 6mil, smd to smd 6mil, copper to edge 15mil, drill to drill 6mil, minimum pad ring 5mil, minimum via ring 5mil, stop-mask expansion 2.5mil, vias tented up to drill 0mil, thermal gap 10mil
Holes 3.3 mm at 3.17,3.17 111.12,60.33 3.17,60.33 111.12,3.17

### Footprints (pad centres in the part's own frame; a part is rotated, then mirrored left to right if it is on the bottom)
DFS = smd 1.5 x 1.7: + -2.55,-4.5; - 2.55,-4.5; AC1 -2.55,4.5; AC2 2.55,4.5
C1206 = smd 1.6 x 1.8: 1 -1.4,0; 2 1.4,0
C1206K = smd 1.5 x 2: 1 -1.5,0; 2 1.5,0
C0805 = smd 1.3 x 1.5: 1 -0.95,0; 2 0.95,0
E5-10,5 = drill 1.016 pad 2.54: + -2.54,0 | drill 1.016 pad 2.54 octagon: - 2.54,0
E2,5-7 = drill 0.813 pad 1.6: + -1.27,0 | drill 0.813 pad 1.6 octagon: - 1.27,0
C1210K = smd 1.5 x 2.9: 1 -1.5,0; 2 1.5,0
C0603 = smd 1.1 x 1: 1 -0.85,0; 2 0.85,0
DO214AC = smd 1.8 x 1.7: A 2.05,0; C -2.05,0
CHIPLED_0805_NOOUTLINE = smd 1.2 x 1.2: A 0,-1.05; C 0,1.05
SOT143B = smd 0.838 x 1.168: 1 -0.747,-1.016 | smd 0.432 x 1.168: 2 0.95,-1.016; 3 0.95,1.016; 4 -0.95,1.016
SOT23-3 = smd 0.889 x 0.787: 1 1.016,0.025; 2 -1.016,-0.94; 3 -1.016,0.991
TE_5558342-1 = drill 0.89 square: 1 -3.175,8.89 | drill 0.89: 2 -4.445,6.35; 3 -1.905,6.35; 4 0.635,6.35; 5 -0.635,8.89; 6 1.905,8.89; 7 4.445,8.89; 8 3.175,6.35 | drill 1.58: SH1 -7.745,3.05; SH2 7.745,3.05 | hole 3.25: -5.715,0; 5.715,0
CON-PHOENIX-3.81-1X3-RA = drill 1.2 square: 1 0,0 | drill 1.2: 2 3.81,0; 3 7.62,0
TC2030-MCP-NL = smd 0.787 x 0.787: 1 1.27,-0.635; 2 1.27,0.635; 3 2.54,-0.635; 4 2.54,0.635; 5 3.81,-0.635; 6 3.81,0.635 | hole 0.991: 0,0; 5.08,-1.016; 5.08,1.016
SSW-103-02-S-S = drill 1 pad 1.5 octagon: 1 -2.54,0; 2 0,0; 3 2.54,0
L3216C = smd 1.2 x 1.6: 1 -1.5,0; 2 1.5,0
IND_1608-M = smd 0.859 x 0.902: 1 -0.929,0; 2 0.929,0
SOT23-5 = smd 1.3 x 0.55: 1 -1.25,0.95; 2 -1.25,0; 3 -1.25,-0.95; 4 1.25,-0.95; 5 1.25,0.95
CONV_PDQE20-Q48-S5-D = drill 1.5 square: 1 -10.16,10.16 | drill 1.5: 2 -10.16,2.54; 3 -10.16,-2.54; 4 10.16,-10.16; 5 10.16,0; 6 10.16,10.16
CUI-78XX-500 = drill 1 square: 1 0,0 | drill 1: 2 2.54,0; 3 5.08,0
R1206 = smd 1.6 x 1.803: 1 -1.422,0; 2 1.422,0
R0805 = smd 1.3 x 1.5: 1 -0.95,0; 2 0.95,0
B3F-10XX = drill 1.016 long: 1 -3.251,2.261; 2 3.251,2.261; 3 -3.251,-2.261; 4 3.251,-2.261
RP-ULTRA = smd 0.6 x 1.2: 1 -4.445,-4.445; 2 -3.175,-4.445; 3 -1.905,-4.445; 4 -0.635,-4.445; 5 0.635,-4.445; 6 1.905,-4.445; 7 3.175,-4.445; 8 4.445,-4.445; 9 4.445,4.445; 10 3.175,4.445; 11 1.905,4.445; 12 0.635,4.445; 13 -0.635,4.445; 14 -1.905,4.445; 15 -3.175,4.445; 16 -4.445,4.445
KEYSTONE_TP500X = drill 1.016: 1 0,0
DDA8_3P1X2P4-M = smd 2.083 x 0.584: 1 -2.616,1.905; 2 -2.616,0.635; 3 -2.616,-0.635; 4 -2.616,-1.905; 5 2.616,-1.905; 6 2.616,-0.635; 7 2.616,0.635; 8 2.616,1.905 | smd 2.4 x 3.1: EPAD 0,0
SOIC254P675X240-4N = smd 1.89 x 0.59: 1 -3.01,1.27; 2 -3.01,-1.27; 3 3.01,-1.27; 4 3.01,1.27
TQFP64_10X10MC = smd 1.473 x 0.229: 1 -5.613,3.75; 2 -5.613,3.25; 3 -5.613,2.75; 4 -5.613,2.25; 5 -5.613,1.75; 6 -5.613,1.25; 7 -5.613,0.75; 8 -5.613,0.25; 9 -5.613,-0.25; 10 -5.613,-0.75; 11 -5.613,-1.25; 12 -5.613,-1.75; 13 -5.613,-2.25; 14 -5.613,-2.75; 15 -5.613,-3.25; 16 -5.613,-3.75; 33 5.613,-3.75; 34 5.613,-3.25; 35 5.613,-2.75; 36 5.613,-2.25; 37 5.613,-1.75; 38 5.613,-1.25; 39 5.613,-0.75; 40 5.613,-0.25; 41 5.613,0.25; 42 5.613,0.75; 43 5.613,1.25; 44 5.613,1.75; 45 5.613,2.25; 46 5.613,2.75; 47 5.613,3.25; 48 5.613,3.75 | smd 0.229 x 1.473: 17 -3.75,-5.613; 18 -3.25,-5.613; 19 -2.75,-5.613; 20 -2.25,-5.613; 21 -1.75,-5.613; 22 -1.25,-5.613; 23 -0.75,-5.613; 24 -0.25,-5.613; 25 0.25,-5.613; 26 0.75,-5.613; 27 1.25,-5.613; 28 1.75,-5.613; 29 2.25,-5.613; 30 2.75,-5.613; 31 3.25,-5.613; 32 3.75,-5.613; 49 3.75,5.613; 50 3.25,5.613; 51 2.75,5.613; 52 2.25,5.613; 53 1.75,5.613; 54 1.25,5.613; 55 0.75,5.613; 56 0.25,5.613; 57 -0.25,5.613; 58 -0.75,5.613; 59 -1.25,5.613; 60 -1.75,5.613; 61 -2.25,5.613; 62 -2.75,5.613; 63 -3.25,5.613; 64 -3.75,5.613
SOT95P270X145-6N = smd 1.321 x 0.559: 1 -1.295,0.94; 2 -1.295,0; 3 -1.295,-0.94; 4 1.295,-0.94; 5 1.295,0; 6 1.295,0.94
SOT23-5' = smd 0.69 x 0.99: 1 -0.95,-1.29; 2 0,-1.29; 3 0.95,-1.29; 4 0.95,1.3; 5 -0.95,1.3

### Placement (x,y rotation side)
BR1  19.05,27.94 0 top
BR2  8.89,27.94 0 top
C1  19.68,44.13 90 bottom
C2  22.23,44.13 90 bottom
C3  25.4,44.13 90 bottom
C4  27.94,44.13 90 bottom
C5  19.68,55.24 90 bottom
C6  30.8,60.8 0 bottom
C7  2.54,12.7 270 top
C8  15.24,12.7 270 top
C9  30.48,22.86 90 top
C10  68.58,12.7 90 top
C11  76.52,15.56 0 top
C12  76.52,18.73 0 top
C13  83.5,15.24 180 top
C14  83.5,18.73 180 top
C15  85.09,55.56 0 top
C16  75.56,46.99 90 top
C17  78.11,46.99 90 top
C18  68.58,46.99 90 top
C19  71.12,46.99 90 top
C20  75.56,52.7 90 top
C21  78.11,52.7 90 top
C22  64.14,50.8 180 top
C23  64.14,53.34 180 top
C24  65.25,43.18 270 top
C25  62.55,44.13 270 top
C26  84.3,29.37 180 top
C27  84.61,46.67 180 top
C28  92.39,38.89 0 top
C29  91.6,33.97 270 top
C30  74.93,37.31 180 top
C31  51.44,43.81 270 top
C32  52.39,60.17 0 top
C33  94.61,53.02 90 top
C34  99.54,13.34 90 top
D1  11.43,12.7 270 top
D2  17.46,3.81 270 top
D3  27.94,3.81 270 top
D4  38.58,40.01 270 top
D5  43.81,50.16 270 top
D6  43.81,56.52 270 top
D7  92.23,12.7 0 top
D8  88.9,12.7 0 top
D9  102.87,11.43 270 top
D10  62.23,34.29 90 top
D11  62.23,36.83 90 top
D12  98.58,39.85 90 top
D13  98.58,33.02 90 top
J1  7.62,48.26 270 top
J2  108.74,11.43 90 top
J3  99.06,45.72 0 top
J4  111.76,45.72 90 top
L1  6.35,15.24 0 top
L2  6.35,10.16 0 top
L3  63.66,55.56 180 top
L4  58.74,42.07 180 top
L5  58.74,43.5 180 top
OSC1  85.09,52.07 270 top
PS1  50.8,16.51 0 top
PS2  77.47,7.62 0 top
R1  19.68,49.53 270 bottom
R2  22.23,49.53 270 bottom
R3  25.4,49.53 270 bottom
R4  27.94,49.53 270 bottom
R5  38.73,50.16 0 top
R6  38.73,47.62 0 top
R7  38.73,56.52 0 top
R8  38.73,53.98 0 top
R9  19.05,15.24 90 top
R10  19.05,10.16 90 top
R11  30.48,33.66 0 top
R12  30.48,30.48 0 top
R13  12.7,3.81 0 top
R14  22.86,3.81 0 top
R15  30.48,36.51 0 top
R16  33.5,40.01 0 top
R17  56.67,36.83 90 top
R18  92.23,7.62 90 top
R19  88.9,7.62 90 top
R20  100.97,25.4 270 top
R21  100.97,29.53 90 top
R22  98.58,37.62 180 top
R23  98.58,35.24 180 top
R24  108.74,42.23 270 top
R25  108.74,46.67 90 top
R26  67.31,34.29 0 top
R27  67.31,36.83 0 top
R28  103.66,53.02 270 top
R29  102.87,15.08 0 top
R30  74.3,39.37 180 top
R31  51.44,48.26 270 top
R32  48.74,49.21 270 top
R33  51.44,56.52 270 top
R34  48.74,57.47 270 top
SW1  108.58,26.67 0 top
SW2  108.58,34.29 0 top
T1  30.48,52.07 90 top
TP1  11.43,17.78 0 top
TP2  11.43,7.62 0 top
TP3  31.75,7.62 0 top
TP4  11.43,35.56 0 top
TP5  6.35,35.56 0 top
TP6  21.59,35.56 0 top
TP7  16.51,35.56 0 top
TP8  68.58,19.05 0 top
TP9  68.58,6.35 0 top
TP10  36.2,33.66 0 top
TP11  41.91,35.56 0 top
TP12  68.58,24.13 0 top
TP13  15.08,60.01 0 top
U1  25.4,12.7 0 top
U2  49.53,36.83 0 top
U3  83.82,38.1 90 top
U4  91.44,53.18 270 top
U5  SN74LV1T125DBVR  [SOT23-5']  96.2,13.49 180 top

### Tracks (layer width: path | path; a pad name or v marks a point on that pad's centre or on a via)
+3V3  (via drill 0.25, 0.5)
  Top 0.152: J3.2 100.33,46.99 v100.65,47.31
  Bottom 0.152: v100.65,47.31 v100.65,48.58 | v84.77,42.23 v84.77,40.96
  Bottom 0.406: v60.8,56.83 v60.8,59.37 | v56.04,41.43 v56.04,43.97 | v70.01,39.69 v70.01,42.23 | v73.5,56.83 v73.5,59.37
  Bottom 0.61: v77.31,44.29 v78.9,44.29
  pour Top (isolate 0.152, rank 2): 31.75,63.5 31.75,45.72 34.29,43.18 49.53,43.18 49.53,0 114.3,0 114.3,63.5
+5V
  Top 0.152: U5.5 99.34,12.19 C34.1 101.87,12.38 D9.2 101.93,12.37 102.87,11.43 J2.1
  Top 0.254: C12.1 75.57,16.11 C11.1 75.02,10.07 PS2.1 | R18.1 92.23,3.17
  Top 1.27: 68.58,3.17 TP9.1 C10.+ | PS2.1 77.47,3.49 77.15,3.17
  Top 2.54: J2.1 108.74,8.1 103.82,3.17 92.23,3.17 77.15,3.17 68.58,3.17 64.14,3.17 PS1.4
/MCLR  (via drill 0.25)
  Top 0.152: U3.7 v83.07,36.87 | J3.1 100.33,44.29 100.01,43.97 98.27,43.97 v98.11,44.13 | v85.57,39.37 89.22,43.02 97.95,43.02 v98.11,42.86 104.93,42.86 105.57,43.5 105.57,51.44 104.93,52.07 R28.2
  Bottom 0.152: v98.11,44.13 v98.11,42.86 | v83.07,36.87 v85.57,39.37
CDB  (via drill 0.5)
  Top 0.254: U1.6 v30.16,12.06 | PS1.1 38.1,26.67 36.2,28.57 TP10.1 R11.2 31.9,32.54 31.43,32.07 29.53,32.07 29.06,31.6 R12.1
  Bottom 0.254: v30.16,12.06 37.47,12.06 38.1,12.7 38.1,24.13 PS1.1
CHASSIS_SHIELD_GND
  Bottom 0.254: TP13.1 15.08,56.9 15.24,56.74
  Bottom 0.61: C6.2 20.64,60.8 19.68,59.85 C5.2
  Bottom 0.813: C5.2 15.24,56.74 11.41,56.74 J1.SH1 J1.SH2
CLK25
  Top 0.152: U3.39 84.57,47.9 86.04,49.37 OSC1.5
  Top 0.254: OSC1.5
CS_E48  (via drill 0.25)
  Top 0.152: U3.44 82.07,56.35 83.03,57.31 90.01,57.31 v90.33,56.99 | v90.81,50.16 91.12,50.16 91.44,50.48 U4.5
  Bottom 0.152: v90.33,56.99 90.33,50.64 v90.81,50.16
DATA_5V
  Top 0.152: U5.4 95.25,13.02 95.57,13.34 101.44,13.34 101.92,13.81 R29.1
GND  (via drill 0.25, 0.5)
  Top 0.152: C20.2 v75.56,55.24 | C21.2 v78.11,55.24 | C17.2 v78.11,49.53 | C16.2 v75.56,49.53 | C19.2 v71.12,49.53 | C18.2 v68.58,49.53 | C23.2 v61.59,53.34 | C22.2 v61.59,50.8 | D6.1 42.8,58.17 v42.55,58.42 | D5.1 42.8,51.82 v42.55,52.07 | C25.1 v62.55,46.51 | C24.1 v65.25,45.56 | U2.3 53.98,35.56 v54.61,34.92 | D10.C v60.01,34.29 | D11.C v60.01,36.83 | R30.2 v71.91,39.37 | C34.2 v99.54,15.72 | D9.1 102.89,8.91 v102.87,8.89 | U5.3 95.25,15.71 v95.09,15.88 | U5.1 97.15,15.71 v97.31,15.88 | v84.14,33.81 84.07,33.75 U3.9 84.07,31.36 83.82,31.11 83.19,31.11 82.9,30.83 C26.2 | U3.20 88.08,35.85 v87.95,35.72 | U3.25 88.2,38.35 v88.11,38.26 | U3.41 83.57,42.32 v83.66,42.23 | U3.45 81.57,42.41 v81.76,42.23 | U3.52 79.35,40.35 v79.38,40.32 | U3.55 79.58,38.85 v79.85,39.05 | U3.56 79.76,38.35 v79.85,38.26 | OSC1.1 87.13,53.32 v87.15,53.34 | U4.2 v91.44,55.88 | C33.2 v94.61,55.4 | J3.3 101.6,44.13 v101.44,43.97 | C28.2 v94.3,38.89 | C29.2 v91.6,32.07 | C30.2 v73.03,37.31 | C27.2 83.66,46.67 83.5,46.51 v83.5,45.24 | C15.2 v87.15,55.56 | D12.C 96.52,39.85 v96.36,40.01 | D13.C v96.36,33.02
  Top 0.254: C12.2 v79.06,18.73 | C14.2 v80.96,18.73 | C11.2 v79.38,15.56 | D7.C v92.23,15.24 | D8.C v88.9,15.24 | C13.2 82,13.42 v81.92,13.34
  Top 0.406: C32.2 v54.77,60.17 | C31.2 v51.44,41.43
  Bottom 2.54: 106.68,19.05 109.22,19.05
  pour Bottom (isolate 0.152): 31.75,63.5 31.75,45.72 34.29,43.18 49.53,43.18 49.53,0 114.3,0 114.3,63.5
ISO_T2P  (via drill 0.25)
  Top 0.152: U2.4 54.13,38.1 54.45,37.78 54.45,36.51 55.08,35.88 R17.1 56.36,35.88 56.36,33.02 57.31,32.07 v61.28,32.07 | U3.64 75.47,34.35 v73.18,32.07
  Bottom 0.152: v73.18,32.07 v61.28,32.07
LED1
  Top 0.152: U3.62 71.07,35.35 70.01,34.29 R26.2
LED2
  Top 0.152: U3.61 70.99,35.85 70.01,36.83 R27.2
LEDA
  Top 0.152: U3.24 96.14,37.85 96.36,37.62 R22.2
LEDB
  Top 0.152: U3.23 95.84,37.35 96.36,36.83 96.36,35.56 96.68,35.24 R23.2
MISO
  Top 0.152: 90.49,51.87 U4.4 88.88,51.89 88.11,51.12 88.11,46.99 86.57,45.45 U3.35
MOSI
  Top 0.152: U4.3 90.47,54.45 90.47,53.65 90.01,53.18 88.42,53.18 87.63,52.39 87.63,46.99 86.07,45.43 U3.36
N$1
  Top 0.61: BR2.+
  Top 0.813: 6.35,21.59 4.85,20.09 L1.1 3.17,15.24 2.54,14.61 C7.1 | 6.35,21.59 BR2.+ | BR1.+ 16.5,22.21 15.88,21.59 6.35,21.59
N$2
  Top 0.152: T1.3 R5.1
N$3
  Top 0.61: 11.43,27.3 11.44,26.66
  Top 0.813: 11.44,26.66 BR2.- | BR1.- 21.6,26.66 20.95,27.3 11.43,27.3 3.17,27.3 0.95,24.77 0.95,12.06 1.27,11.75 C7.2 2.54,10.79 3.17,10.16 L2.1
N$4
  Top 0.152: T1.1 R6.1
N$5
  Bottom 0.813: C4.2 R4.2
N$6
  Top 0.152: T1.8 R7.1
N$7
  Top 0.254: R13.2 D2.A
N$8
  Top 0.152: U3.10 84.57,31.48 84.93,31.11 85.41,31.11 85.7,30.83 C26.1
N$9
  Top 0.152: U3.53 75.72,39.85 R30.1
N$10
  Top 0.152: R23.1 99.53,33.12 D13.A
N$11
  Top 0.152: D10.A R26.1
N$12
  Top 0.254: R15.2 37.78,36.51 39.37,38.1 U2.1
N$13
  Top 0.152: T1.6 R8.1
N$14
  Bottom 0.813: C1.2 R1.2
N$15
  Bottom 0.813: C2.2 R2.2
N$16
  Bottom 0.813: C3.2 R3.2
N$17
  Bottom 0.813: R4.1 R3.1 R2.1 R1.1 C5.1
N$18
  Top 0.152: D11.A R27.1
N$19
  Top 0.254: U1.2 20,13.34 R9.1
N$20
  Top 0.254: U1.3 20,12.06 R10.2
N$21
  Top 0.152: D12.A 99.63,37.72 R22.1
N$22
  Top 0.254: R14.2 D3.A
N$23
  Top 0.254: R16.2 D4.A
N$24
  Top 0.254: R18.2 D7.A
N$25
  Top 0.254: D8.A R19.2
NEO_DOUT  (via drill 0.25)
  Top 0.152: U3.5 82.07,33.81 v81.6,34.29 | v85.09,22.38 78.9,28.57 78.9,33.18 v80.01,34.29 | v94.61,19.84 96.2,18.26 U5.2
  Bottom 0.152: v85.09,22.38 87.63,19.84 v94.61,19.84 | v81.6,34.29 v80.01,34.29
NEO_DOUT_5V
  Top 0.152: J2.2 103.98,15.24 R29.2 103.82,12.49 D9.3
PGC
  Top 0.152: U3.42 83.07,42.02 83.5,41.59 87.31,41.59 89.22,43.5 100.81,43.5 100.97,43.34 102.08,43.34 102.87,44.13 J3.5
PGD
  Top 0.152: U3.37 85.57,42.54 85.72,42.39 87.63,42.39 89.22,43.97 97,43.97 97.47,44.45 97.47,47.15 98.27,47.94 101.12,47.94 101.6,47.47 J3.4
RD_CT
  Top 0.406: T1.7 33.66,55.24 33.02,55.88 33.02,59.53 33.66,60.17 48.74,60.17 | 48.74,60.17 C32.1 R33.1 | R34.1 48.74,60.17
RD_N
  Top 0.152: R7.2 40.96,56.52 41.91,55.56 D6.2 43.5,55.56 44.45,56.52 R34.2 | 49.06,56.84 49.06,56.52 | 49.06,56.52 49.05,56.52 | U3.46 81.07,44.5 80.96,44.61 80.96,56.25 78.96,58.26 58.99,58.26 56.93,56.19 53.66,56.19 53.33,56.52 R34.2 | R34.2 49.06,56.52
RD_P
  Top 0.152: U3.47 80.57,56.22 78.84,57.95 59.12,57.95 57.05,55.89 53.66,55.89 53.33,55.56 R33.2 D6.3 44.13,55.56 43.5,54.93 41.91,54.93 40.96,53.98 R8.2
RTN
  Top 0.254: C9.- 30.48,27.3 31.9,28.73 R12.2
  pour Top (isolate 0.152): 27.94,27.94 27.94,1.27 44.45,1.27 44.45,27.94
RX_CT  (via drill 0.5)
  Top 0.61: BR1.AC2
  Top 0.813: T1.10 27.94,55.24 29.21,53.98 29.21,41.27 v28.65,40.72 25.4,37.47 22.23,37.47 21.59,36.83 TP6.1 BR1.AC2
  Bottom 0.813: C4.1 27.94,41.43 v28.65,40.72
RX_N
  Top 0.254: J1.6 15.24,47.62 15.24,48.11 14.48,48.87 13.56,48.87 12.04,50.39 12.04,53.34 15.21,56.52 T1.9
RX_P
  Top 0.152: 18.62,54.38 18.53,54.38
  Top 0.254: 18.62,54.38 arc90 18.89,54.65 18.89,55.59 arc-90 19.15,55.86 19.24,55.86 arc-90 19.51,55.59 19.51,54.65 arc90 19.78,54.38 19.87,54.38 arc90 20.13,54.65 20.13,55.59 arc-90 20.4,55.86 20.49,55.86 arc-90 20.76,55.59 20.76,55.38 arc90 21.02,55.12 23.98,55.12 25.12,53.98 T1.11 | 18.53,54.38 arc-90 18.26,54.65 18.26,55.59 arc90 18,55.86 17.91,55.86 arc90 17.64,55.59 17.64,55.38 arc-90 17.37,55.12 14.59,55.12 12.55,53.07 12.55,51.59 J1.3
RXD  (via drill 0.25)
  Top 0.152: U3.32 v97.37,41.85 | v106.14,41.85 107.31,43.02 107.31,47.31 107.63,47.62 R25.2
  Bottom 0.152: v97.37,41.85 v106.14,41.85
RXIN
  Top 0.152: R25.1 J4.2
SCK  (via drill 0.25)
  Top 0.152: 92.39,54.46 U4.1 92.38,53.49 91.92,53.02 90.33,53.02 90.01,52.7 88.74,52.7 v88.42,52.39 | v88.74,49.53 88.74,47.15 87.07,45.48 U3.34
  Bottom 0.152: v88.42,52.39 88.42,49.85 v88.74,49.53
SPARE_0
  Top 0.61: TP5.1
  Top 0.813: BR2.AC1 TP5.1 | TP5.1 8.26,37.47 11.43,37.47 12.7,38.73 12.7,43.5 12.06,44.13 12.06,46.99 12.7,47.62 J1.4
  Bottom 0.813: C2.1 22.23,41.43 21.75,40.96 13.49,40.96 12.22,42.23 12.22,45.88 J1.4 15.24,48.9 J1.5
SPARE_1
  Top 0.61: TP4.1
  Top 0.813: BR2.AC2 TP4.1 | TP4.1 13.97,38.1 J1.8
  Bottom 0.61: 19.66,42.7 C1.1
  Bottom 0.813: J1.8 15.24,43.81 J1.7 17.62,42.7 19.66,42.7
SW1  (via drill 0.25)
  Top 0.152: SW1.2 SW1.1 102.75,26.35 R20.1 v95.89,26.35 | U3.3 81.07,27.67 v82.39,26.35
  Bottom 0.152: v82.39,26.35 v95.89,26.35
SW2  (via drill 0.25)
  Top 0.152: SW2.2 SW2.1 105.13,36.55 103.03,34.45 103.03,29.05 102.56,28.58 R21.1 99.54,28.57 97.95,26.99 v94.77,26.99 | U3.4 81.57,28.29 v82.87,26.99
  Bottom 0.152: v82.87,26.99 83.03,26.83 94.61,26.83 v94.77,26.99
T2P  (via drill 0.5)
  Top 0.254: U1.7 v30.16,13.34 | TP11.1 U2.2 | D4.C 41.27,40.01 v41.59,39.69
  Bottom 0.254: v30.16,13.34 36.83,13.34 37.47,13.97 37.47,32.7 40.32,35.56 TP11.1 41.59,35.88 v41.59,39.69
TD_CT  (via drill 0.5)
  Top 0.152: 78.11,41.95 U3.49 75.31,41.85 C19.1 | U3.48 80.07,49.79 C21.1 | U3.54 79.36,39.35 80.01,40.01 80.01,41.91 78.11,43.81 C17.1
  Top 0.406: C31.1 51.44,46.04 | T1.2 33.66,48.9 33.02,48.26 33.02,46.83 33.81,46.04 48.74,46.04 | 51.44,46.04 48.74,46.04 | R32.2 48.74,46.04 | R31.2 51.44,46.04 | 51.44,46.04 v53.34,46.04
  Top 0.61: 66.04,53.34 66.04,51.12 | 66.04,51.12 66.04,48.26 | 66.04,48.26 66.04,46.99 66.99,46.04 C18.1 C19.1 | C23.1 66.04,53.34 | C22.1 66.04,51.12 | C17.1 C16.1 73.97,46.04 73.03,46.99 73.03,49.85 71.75,51.12 66.04,51.12 | C21.1 C20.1 73.97,51.76 72.39,53.34 66.04,53.34 | L3.1 65.41,55.56 66.04,54.93 66.04,53.34 | v62.55,48.26 66.04,48.26
  Bottom 0.406: v53.34,46.04 57.15,46.04 59.37,48.26 v62.55,48.26
TD_N
  Top 0.152: R5.2 40.96,50.16 41.91,49.22 D5.2 43.5,49.22 44.45,50.16 R32.1 53.34,50.16 53.66,49.85 54.19,49.85 55.08,48.96 55.08,43.4 55.51,42.97 56.62,42.97 57.15,43.5 L5.2
TD_P
  Top 0.152: L4.2 57.15,42.07 56.62,42.6 55.3,42.6 54.77,43.12 54.77,48.83 54.08,49.53 53.66,49.53 53.34,49.22 R31.1 D5.3 44.13,49.21 43.5,48.58 41.91,48.58 40.96,47.62 R6.2
TDF_N
  Top 0.152: 62.55,43.02 C25.2 | U3.50 77.07,41.35 76.91,41.19 68.24,41.19 66.25,43.18 C25.2 | L5.1 60.32,43.5 60.64,43.18 61.28,43.18 C25.2
TDF_P
  Top 0.152: U3.51 68,40.85 66.78,42.07 65.24,42.07 C24.2 60.49,42.23 60.33,42.07 L4.1
TX_CT  (via drill 0.5)
  Top 0.61: BR1.AC1
  Top 0.813: T1.15 27.3,48.9 27.94,48.26 27.94,41.91 26.04,40.01 | 26.04,40.01 24.77,38.73 17.78,38.73 16.51,37.47 TP7.1 BR1.AC1 | v25.4,41.12 25.4,40.64 26.04,40.01
  Bottom 0.813: C3.1 v25.4,41.12
TX_N
  Top 0.254: T1.14 24.92,50.16 22.38,52.7 J1.2
TX_P
  Top 0.254: T1.16 25.17,47.62 21.36,51.44 20.15,51.44 arc90 19.89,51.17 19.89,50.47 arc-90 19.62,50.2 19.58,50.2 arc-90 19.32,50.47 19.32,51.17 arc90 19.05,51.44 J1.1
TXD  (via drill 0.25)
  Top 0.152: U3.31 v98.02,41.35 | v107.23,41.35 108.67,41.35 R24.2
  Bottom 0.152: v98.02,41.35 v107.23,41.35
TXOUT
  Top 0.152: R24.1 J4.1
VNNIN  (via drill 0.5, 1.4)
  Top 0.254: 11.43,10.16 TP2.1 17.46,7.62 18.41,6.67 18.41,3.91 D2.C
  Top 0.61: U1.EPAD v25.4,11.43 26.04,10.79 | 22.78,9.29 22.86,9.21 | 26.04,14.92 26.04,10.79 | 24.77,14.92 24.77,14.29 | 24.77,14.29 24.77,10.79 | 24.77,14.29 25.72,14.29 v25.4,13.97 | 24.77,10.79 26.04,10.79 | 24.77,10.79 24.77,9.53 24.45,9.21
  Top 0.813: L2.2 11.43,10.16 | D1.A 11.43,10.16 | 24.45,9.21 22.86,9.21 R10.1 17.46,9.21 16.51,10.16 15.24,10.16 | U1.4 22.78,9.29 | 11.43,10.16 15.24,10.16 | C8.2 15.24,10.16
  other vias: 25.4,17.78 25.4,16.51 25.4,8.89 25.4,7.62
  pour Top: 24.45,19.05 24.45,6.35 26.35,6.35 26.35,19.05
  pour Bottom (isolate 0.152): 28.89,17.14 35.56,17.14 35.56,15.24 29.21,15.24 29.21,10 33.97,10 33.97,1.27 19.37,1.27 19.37,21.59 27.62,21.59 27.62,18.41
VPPIN  (via drill 0.5)
  Top 0.254: TP1.1 11.43,15.24 | v9.21,4.45 9.84,3.81 R13.1 13.18,1.91 19.68,1.91 21.44,3.66 R14.1 | 25.4,20.32 25.4,32.7 26.35,33.66 R11.1 R15.1 29.06,38.74 30.32,40.01 R16.1
  Top 0.61: 22.47,16.19 22.78,15.88
  Top 0.813: U1.1 22.78,15.88 22.78,18.97 24.13,20.32 25.4,20.32 C9.+ PS1.3 | L1.2 11.43,15.24 | D1.C 11.43,15.24 | 22.47,16.19 R9.2 17.46,16.19 16.51,15.24 15.24,15.24 | 11.43,15.24 15.24,15.24 | C8.1 15.24,15.24
  Bottom 0.254: v9.21,4.45 9.21,15.56 TP1.1

### Text on the board
_tsilk: TP13 | C32 | D6 | R7 | R34 | R33 | C15 | L3 | U4 | R8 | C23 | C20 | C21 | C33 | R28 | D5 | OSC1 | R5 | C22 | R32 | R25 | R31 | C27 | GND | R6 | C18 | C19 | C16 | C17 | J3 | RXI | T1 | C31 | L5 | C25 | C24 | TXO | D4 | L4 | D12 | J4 | J1 | R16 | R30 | C28 | R24 | U2 | D11 | R27 | R22 | TP5 | TP4 | TP7 | TP6 | R15 | TP11 | R17 | SW2 | TP10 | C30 | R23 | R11 | C29 | D10 | R26 | U3 | * | D13 | R12 | PS1 | R21 | SW1 | C26 | C9 | TP12 | BR2 | BR1 | R20 | TP8 | TP1 | C12 | C14 | GND | L1 | C13 | U1 | C10 | C11 | R29 | R9 | * | DATA | C7 | D1 | C8 | D8 | D7 | U5 | L2 | C34 | D9 | +5V | R10 | TP3 | J2 | TP2 | R19 | R18 | R13 | D2 | R14 | D3 | TP9 | PS2
_bsilk: C6 | C5 | R2 | R3 | R4 | R1 | GND | RXI | TXO | C1 | C2 | C3 | C4 | GND | DATA | +5V